# EAGLE design digimax-dual (EAGLE 4.13)
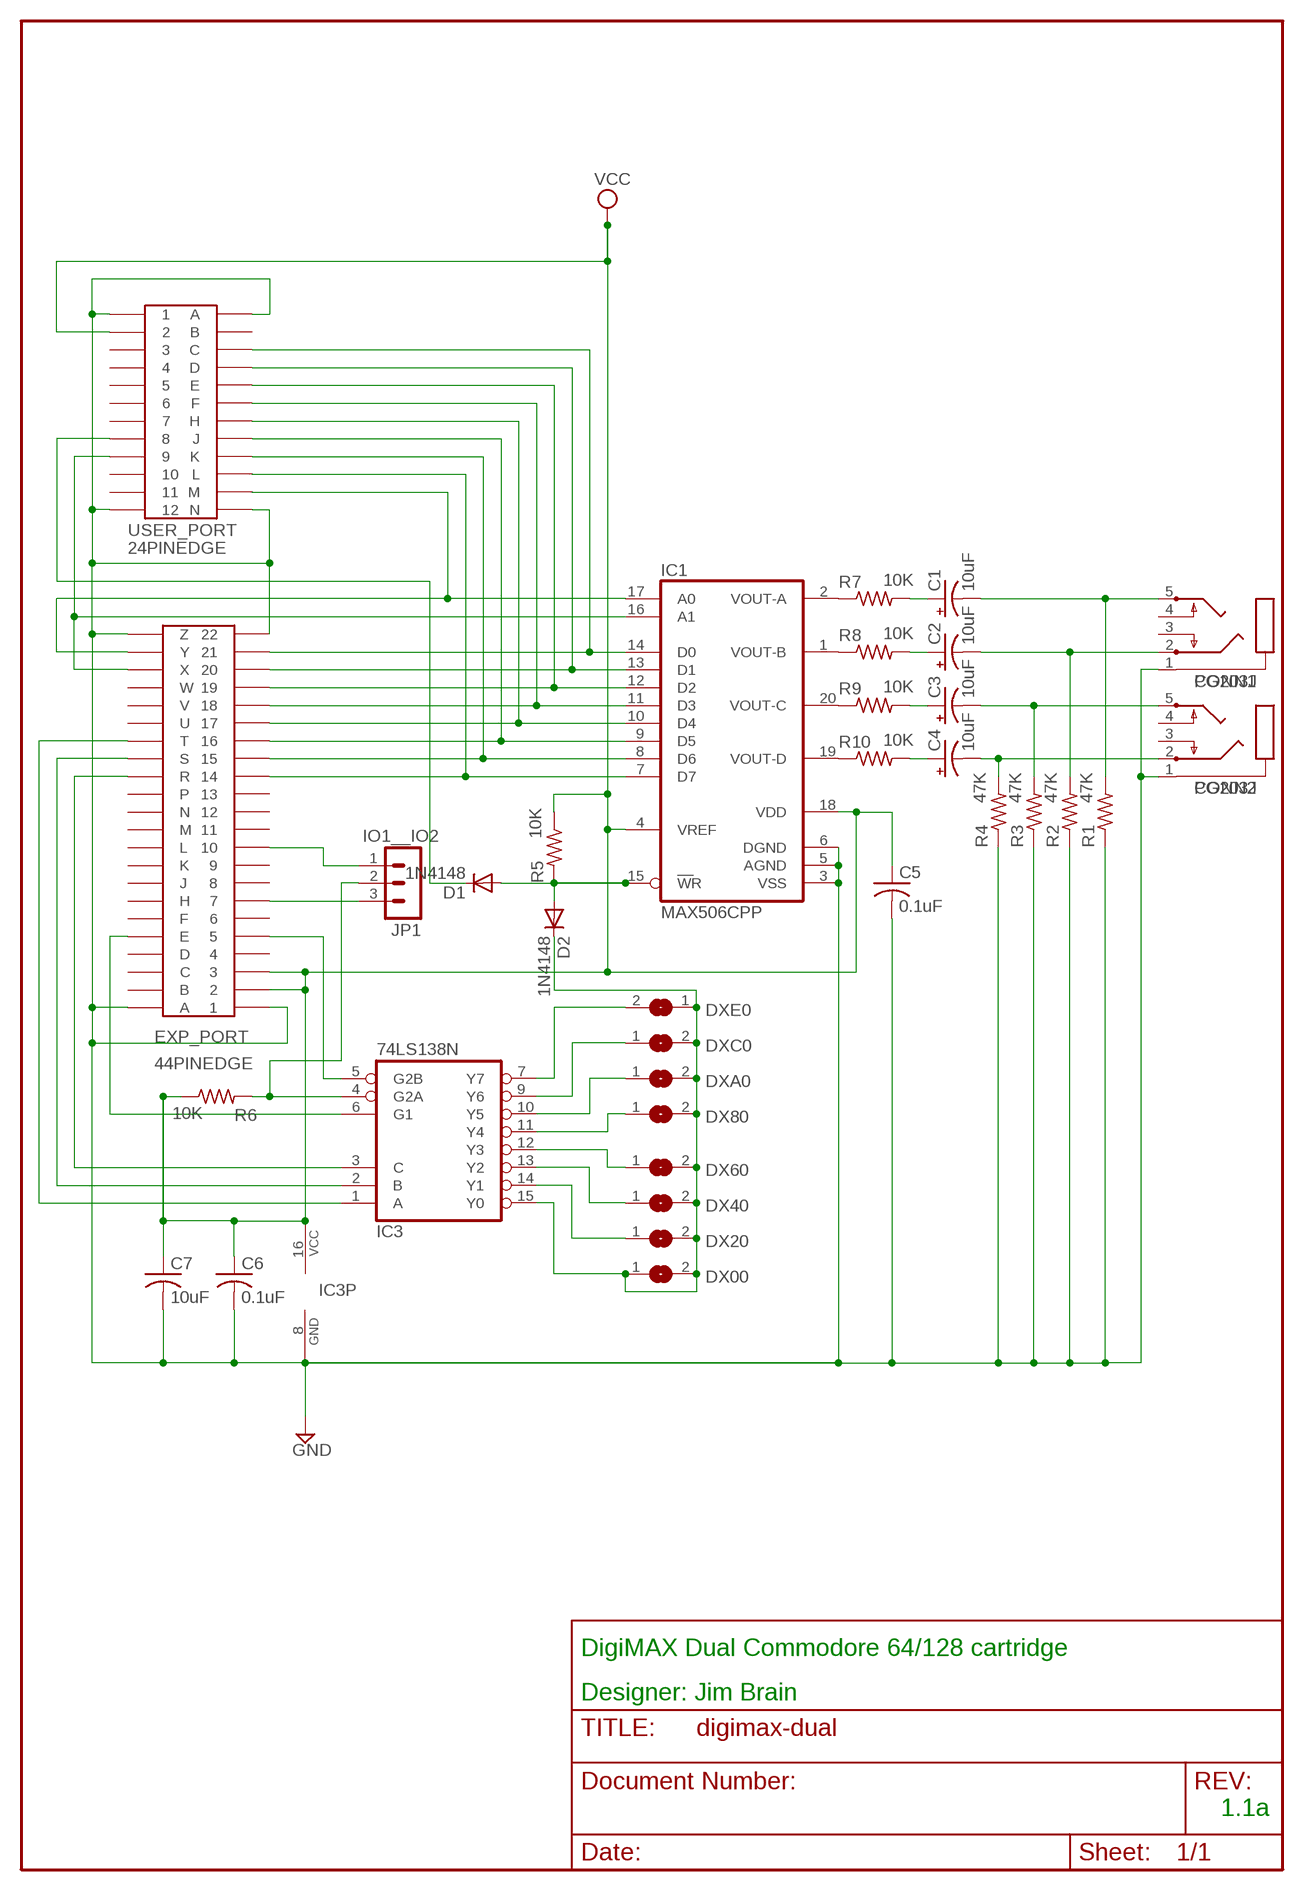
[diagram p0: schematic, sheet 1]

## Parts
C1  10uF  CPOL-USE2-4  [E2-4]
C2  10uF  CPOL-USE2-4  [E2-4]
C3  10uF  CPOL-USE2-4  [E2-4]
C4  10uF  CPOL-USE2-4  [E2-4]
C5  0.1uF  C-US025-024X044  [C025-024X044]
C6  0.1uF  C-US025-024X044  [C025-024X044]
C7  10uF  C-US025-025X050  [C025-025X050]
CONN1  PG203J  [PG203J]
CONN2  PG203J  [PG203J]
D1  1N4148  DIODE-D-2.5  [D-2.5]
D2  1N4148  DIODE-D-2.5  [D-2.5]
DX00  SJ  [SJ]
DX20  SJ  [SJ]
DX40  SJ  [SJ]
DX60  SJ  [SJ]
DX80  SJ  [SJ]
DXA0  SJ  [SJ]
DXC0  SJ  [SJ]
DXE0  SJ  [SJ]
EXP_PORT  44PINEDGE  [44PINEDGE]
IC1  MAX506CPP  [DIL20]
IC3  74LS138N  [DIL16]
JP1  IO1__IO2  MA03-1  [MA03-1]
R1  47K  R-US_0207/2V  [0207/2V]
R2  47K  R-US_0207/2V  [0207/2V]
R3  47K  R-US_0207/2V  [0207/2V]
R4  47K  R-US_0207/2V  [0207/2V]
R5  10K  R-US_0204/7  [0204/7]
R6  10K  R-US_0207/2V  [0207/2V]
R7  10K  R-US_0207/2V  [0207/2V]
R8  10K  R-US_0207/2V  [0207/2V]
R9  10K  R-US_0207/2V  [0207/2V]
R10  10K  R-US_0207/2V  [0207/2V]
USER_PORT  24PINEDGE  [24PINEDGE]

## Nets
GND: C5.2 C6.2 C7.2 CONN1.1 CONN2.1 EXP_PORT.1 EXP_PORT.22 EXP_PORT.A EXP_PORT.Z IC1.3(VSS) IC1.5(AGND) IC1.6(DGND) IC3.8(GND) R1.1 R2.1 R3.1 R4.1 USER_PORT.1 USER_PORT.12 USER_PORT.A USER_PORT.N
N$1: EXP_PORT.21 IC1.14(D0) USER_PORT.C
N$2: EXP_PORT.20 IC1.13(D1) USER_PORT.D
N$3: EXP_PORT.19 IC1.12(D2) USER_PORT.E
N$4: EXP_PORT.18 IC1.11(D3) USER_PORT.F
N$5: EXP_PORT.17 IC1.10(D4) USER_PORT.H
N$6: EXP_PORT.16 IC1.9(D5) USER_PORT.J
N$7: EXP_PORT.15 IC1.8(D6) USER_PORT.K
N$8: EXP_PORT.14 IC1.7(D7) USER_PORT.L
N$9: EXP_PORT.Y IC1.17(A0) USER_PORT.M
N$10: DXE0.2 IC3.7(Y7)
N$11: EXP_PORT.X IC1.16(A1) USER_PORT.9
N$12: EXP_PORT.10 JP1.1
N$13: D1.C USER_PORT.8
N$14: EXP_PORT.7 JP1.3
N$15: EXP_PORT.T IC3.1(A)
N$16: IC3.4(G2A) JP1.2 R6.2
N$17: C1.+ R7.2
N$18: C2.+ R8.2
N$19: C3.+ R9.2
N$20: C4.+ R10.2
N$21: C4.- CONN2.2 R4.2
N$22: C3.- CONN2.5 R3.2
N$23: C2.- CONN1.2 R2.2
N$24: C1.- CONN1.5 R1.2
N$25: EXP_PORT.S IC3.2(B)
N$26: EXP_PORT.R IC3.3(C)
N$27: DXC0.1 IC3.9(Y6)
N$28: EXP_PORT.5 IC3.5(G2B)
N$29: DXA0.1 IC3.10(Y5)
N$30: DX80.1 IC3.11(Y4)
N$31: DX60.1 IC3.12(Y3)
N$32: DX40.1 IC3.13(Y2)
N$33: DX20.1 IC3.14(Y1)
N$35: D2.C DX00.1 DX00.2 DX20.2 DX40.2 DX60.2 DX80.2 DXA0.2 DXC0.2 DXE0.1 IC3.15(Y0)
N$36: IC1.2(VOUT-A) R7.1
N$37: IC1.1(VOUT-B) R8.1
N$38: IC1.20(VOUT-C) R9.1
N$39: IC1.19(VOUT-D) R10.1
N$40: EXP_PORT.E IC3.6(G1)
N$41: D1.A D2.A IC1.15(WR) R5.2
VCC: C5.1 C6.1 C7.1 EXP_PORT.2 EXP_PORT.3 IC1.4(VREF) IC1.18(VDD) IC3.16(VCC) R5.1 R6.1 USER_PORT.2
Unconnected: CONN1.3 CONN1.4 CONN2.3 CONN2.4 EXP_PORT.4 EXP_PORT.6 EXP_PORT.8 EXP_PORT.9 EXP_PORT.11 EXP_PORT.12 EXP_PORT.13 EXP_PORT.B EXP_PORT.C EXP_PORT.D EXP_PORT.F EXP_PORT.H EXP_PORT.J EXP_PORT.K EXP_PORT.L EXP_PORT.M EXP_PORT.N EXP_PORT.P EXP_PORT.U EXP_PORT.V EXP_PORT.W USER_PORT.3 USER_PORT.4 USER_PORT.5 USER_PORT.6 USER_PORT.7 USER_PORT.10 USER_PORT.11 USER_PORT.B

## Notes on the sheet
- DigiMAX Dual Commodore 64/128 cartridge
- Designer: Jim Brain
- 1.1a

## Library data of the parts
C1-C4 = rcl:CPOL-US: POLARIZED CAPACITOR, American symbol
C5-C7 = rcl:C-US: CAPACITOR, American symbol
CONN1 CONN2 = con-hirschmann:PG203J: MIC/HEADPHONE JACK KS-S stereo microphone/headphone jack PG203JN (Schukat)
D1 D2 = diode:DIODE-: DIODE
DX00 DX20 DX40 DX60 DX80 DXA0 DXC0 DXE0 = jumper:SJ: SMD solder JUMPER
EXP_PORT = edge-100:44PINEDGE: 44 PIN EDGE CONNECTOR FOR PCB
IC1 = maxim:MAX506CPP: DIGITAL/ANALOG CONVERTER
IC3 = 74xx-us:74*138: 3-line to 8-line DECODER/DEMULTIPLEXER
JP1 = con-lstb:MA03-1: PIN HEADER
R1-R10 = rcl:R-US_: RESISTOR, American symbol
USER_PORT = edge-156:24PINEDGE

## Board
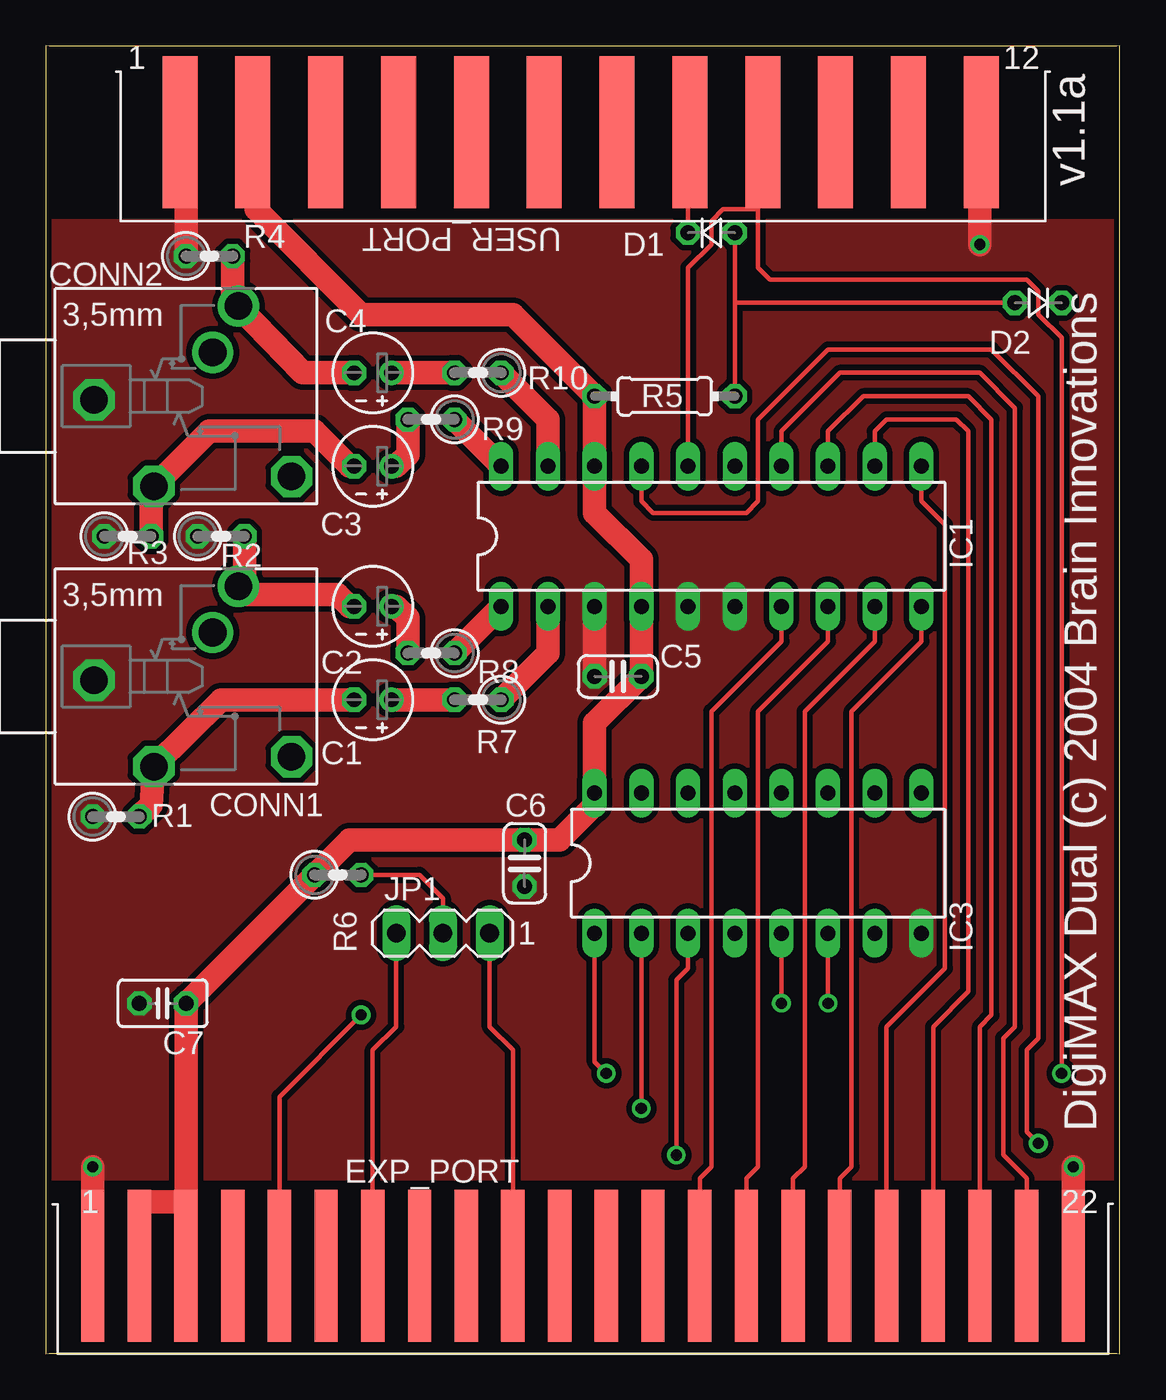
[diagram p1: board, top side]
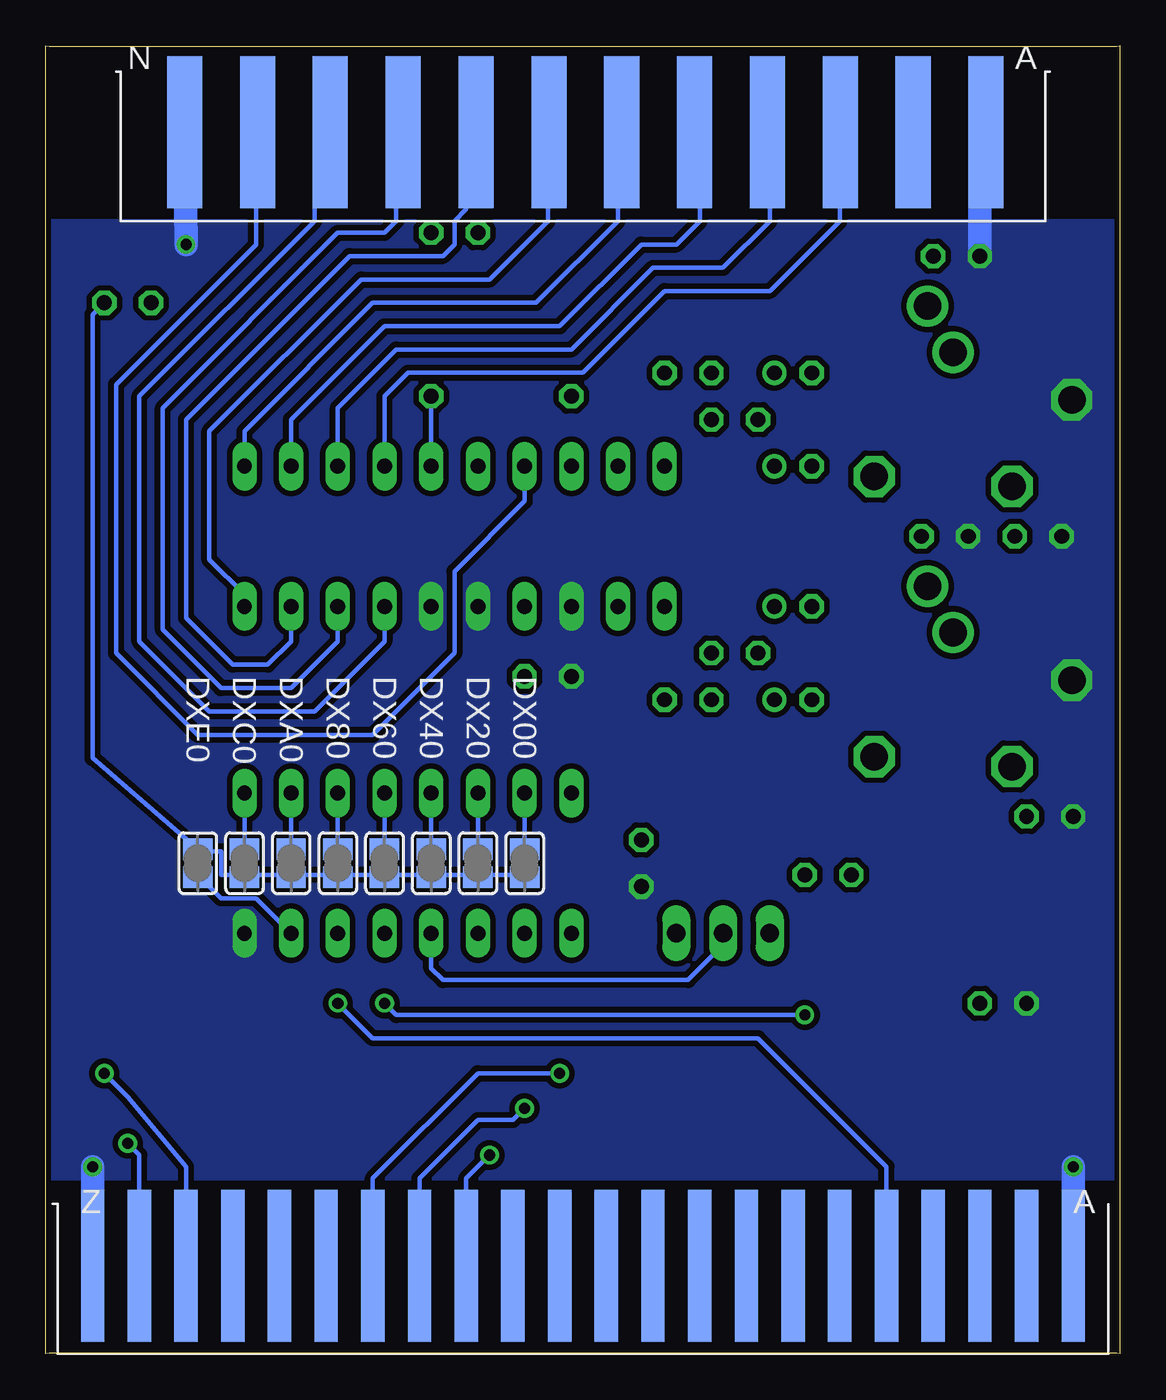
[diagram p2: board, bottom side, seen from below]

Size 58.42 x 71.12 mm. Coordinates in mm from the lower left corner, seen from the top.
Outline: 0.17,0.01 58.26,0.01 58.42,0 58.42,71.12 58.26,71.11 0.17,71.11 0,71.12 0,0 0.17,0.01
Copper layers (1*16): Top 0.035mm / dielectric 1.5mm / Bottom 0.035mm
Design rules "default": minimum track width 10mil, minimum drill 24mil, track to track 12mil, track to pad 12mil, pad to pad 12mil, via to via 12mil, smd to smd 12mil, copper to edge 12mil, drill to drill 8mil, minimum pad ring 10mil, minimum via ring 8mil, stop-mask expansion 4mil, vias tented up to drill 0mil, thermal gap 10mil

### Footprints (pad centres in the part's own frame; a part is rotated, then mirrored left to right if it is on the bottom)
E2-4 = drill 0.813 pad 1.27 round: + -1.016,0 | drill 0.813 pad 1.27 octagon: - 1.016,0
C025-024X044 = drill 0.813 octagon: 1 -1.27,0; 2 1.27,0
C025-025X050 = drill 0.813 octagon: 1 -1.27,0; 2 1.27,0
PG203J = drill 1.499 octagon: 1 -5.004,-0.203; 4 5.74,-4.369; 5 -1.753,-4.902 | drill 1.499 round: 2 2.845,4.902; 3 1.448,2.388
D-2.5 = drill 0.813 octagon: A 1.27,0; C -1.27,0
SJ = smd 1.168 x 1.6: 1 -0.762,0; 2 0.762,0
44PINEDGE = smd 1.27 x 8.255: 1 -24.765,-0.305; 2 -22.225,-0.305; 3 -19.685,-0.305; 4 -17.145,-0.305; 5 -14.605,-0.305; 6 -12.065,-0.305; 7 -9.525,-0.305; 8 -6.985,-0.305; 9 -4.445,-0.305; 10 -1.905,-0.305; 11 0.635,-0.305; 12 3.175,-0.305; 13 5.715,-0.305; 14 8.255,-0.305; 15 10.795,-0.305; 16 13.335,-0.305; 17 15.875,-0.305; 18 18.415,-0.305; 19 20.955,-0.305; 20 23.495,-0.305; 21 26.035,-0.305; 22 28.575,-0.305 | smd 1.27 x 8.255 bottom: A -24.765,-0.305; B -22.225,-0.305; C -19.685,-0.305; D -17.145,-0.305; E -14.605,-0.305; F -12.065,-0.305; H -9.525,-0.305; J -6.985,-0.305; K -4.445,-0.305; L -1.905,-0.305; M 0.635,-0.305; N 3.175,-0.305; P 5.715,-0.305; R 8.255,-0.305; S 10.795,-0.305; T 13.335,-0.305; U 15.875,-0.305; V 18.415,-0.305; W 20.955,-0.305; X 23.495,-0.305; Y 26.035,-0.305; Z 28.575,-0.305
DIL20 = drill 0.813 long: 1 -11.43,-3.81; 2 -8.89,-3.81; 3 -6.35,-3.81; 4 -3.81,-3.81; 5 -1.27,-3.81; 6 1.27,-3.81; 7 3.81,-3.81; 8 6.35,-3.81; 9 8.89,-3.81; 10 11.43,-3.81; 11 11.43,3.81; 12 8.89,3.81; 13 6.35,3.81; 14 3.81,3.81; 15 1.27,3.81; 16 -1.27,3.81; 17 -3.81,3.81; 18 -6.35,3.81; 19 -8.89,3.81; 20 -11.43,3.81
DIL16 = drill 0.813 long: 1 -8.89,-3.81; 2 -6.35,-3.81; 3 -3.81,-3.81; 4 -1.27,-3.81; 5 1.27,-3.81; 6 3.81,-3.81; 7 6.35,-3.81; 8 8.89,-3.81; 9 8.89,3.81; 10 6.35,3.81; 11 3.81,3.81; 12 1.27,3.81; 13 -1.27,3.81; 14 -3.81,3.81; 15 -6.35,3.81; 16 -8.89,3.81
MA03-1 = drill 1.016 long: 1 -2.54,0; 2 0,0; 3 2.54,0
0207/2V = drill 0.813 octagon: 1 -1.27,0; 2 1.27,0
0204/7 = drill 0.813 octagon: 1 -3.81,0; 2 3.81,0
24PINEDGE = smd 1.905 x 8.255: 1 -21.285,-0.254; 2 -17.323,-0.254; 3 -13.36,-0.254; 4 -9.398,-0.254; 5 -5.436,-0.254; 6 -1.473,-0.254; 7 2.489,-0.254; 8 6.452,-0.254; 9 10.414,-0.254; 10 14.376,-0.254; 11 18.339,-0.254; 12 22.301,-0.254 | smd 1.905 x 8.255 bottom: A -21.285,-0.254; B -17.323,-0.254; C -13.36,-0.254; D -9.398,-0.254; E -5.436,-0.254; F -1.473,-0.254; H 2.489,-0.254; J 6.452,-0.254; K 10.414,-0.254; L 14.376,-0.254; M 18.339,-0.254; N 22.301,-0.254

### Placement (x,y rotation side)
C1  17.78,35.56 180 top
C2  17.78,40.64 180 top
C3  17.78,48.26 180 top
C4  17.78,53.34 180 top
C5  31.11,36.83 180 top
C6  26.04,26.67 270 top
C7  6.35,19.05 180 top
CONN1  7.62,36.83 0 top
CONN2  7.62,52.07 0 top
D1  36.2,60.96 0 top
D2  53.98,57.15 180 top
DX00  32.38,26.67 270 bottom
DX20  34.92,26.67 270 bottom
DX40  37.47,26.67 270 bottom
DX60  40.01,26.67 270 bottom
DX80  42.55,26.67 270 bottom
DXA0  45.09,26.67 270 bottom
DXC0  47.62,26.67 270 bottom
DXE0  50.16,26.67 270 bottom
EXP_PORT  27.3,5.08 0 top
IC1  36.2,44.45 0 top
IC3  38.73,26.67 0 top
JP1  21.59,22.86 180 top
R1  3.81,29.21 0 top
R2  9.53,44.45 0 top
R3  4.45,44.45 0 top
R4  8.89,59.69 0 top
R5  33.66,52.07 0 top
R6  15.88,26.04 0 top
R7  23.5,35.56 180 top
R8  20.95,38.1 180 top
R9  20.95,50.8 180 top
R10  23.5,53.34 180 top
USER_PORT  28.57,66.67 0 top

### Tracks (layer width: path | path; a pad name or v marks a point on that pad's centre or on a via)
GND  (via drill 0.61)
  Top 1.27: C5.2 IC1.3 | EXP_PORT.22 v55.88,10.16 | USER_PORT.N 50.8,66.42 v50.8,60.33 | EXP_PORT.1 v2.54,10.16 | R4.1 7.62,62.87 USER_PORT.A
  Bottom 1.27: R4.1 7.62,62.87 USER_PORT.A | v55.88,10.16 EXP_PORT.22 | 2.54,5.08 EXP_PORT.1 v2.54,10.16 | v50.8,60.33 USER_PORT.N
  pour Bottom (no thermals): 0,61.59 58.42,61.59 58.42,9.53 0,9.53
  pour Top (no thermals): 0,61.59 58.42,61.59 58.42,9.53 0,9.53
N$1
  Top 0.254: EXP_PORT.21 53.34,9.53 52.07,10.79 52.07,17.14 52.7,17.78 52.7,51.44 50.8,53.34 43.18,53.34 40.01,50.16 IC1.14
  Bottom 0.254: USER_PORT.C 15.24,63.5 15.24,61.59 19.05,57.78 24.77,57.78 29.21,53.34 38.73,53.34 40.01,52.07 IC1.14
N$2
  Top 0.254: EXP_PORT.20 50.8,17.78 51.44,18.41 51.44,50.8 50.16,52.07 44.45,52.07 42.55,50.16 IC1.13
  Bottom 0.254: USER_PORT.D 19.05,63.5 19.05,61.59 21.59,59.05 25.4,59.05 29.84,54.61 39.37,54.61 42.55,51.44 IC1.13
N$3
  Top 0.254: EXP_PORT.19 48.26,17.78 50.16,19.68 50.16,50.16 49.53,50.8 45.72,50.8 45.09,50.16 IC1.12
  Bottom 0.254: USER_PORT.E 22.86,62.87 22.86,61.59 24.13,60.33 26.04,60.33 30.48,55.88 40.01,55.88 45.09,50.8 IC1.12
N$4
  Top 0.254: EXP_PORT.18 45.72,17.78 48.9,20.95 48.9,45.09 47.62,46.35 IC1.11
  Bottom 0.254: USER_PORT.F 27.3,63.5 27.3,61.59 31.75,57.15 40.64,57.15 47.62,50.16 IC1.11
N$5
  Top 0.254: EXP_PORT.17 43.18,9.53 43.81,10.16 43.81,34.92 47.62,38.73 IC1.10
  Bottom 0.254: USER_PORT.H 31.11,61.59 34.29,58.42 41.27,58.42 49.53,50.16 49.53,43.18 47.62,41.27 IC1.10
N$6
  Top 0.254: EXP_PORT.16 40.64,9.53 41.27,10.16 41.27,34.92 45.09,38.73 IC1.9
  Bottom 0.254: USER_PORT.J 35.56,62.23 36.2,61.59 36.2,60.33 36.83,59.69 41.91,59.69 50.8,50.8 50.8,40.01 48.26,37.47 46.35,37.47 45.09,38.73 IC1.9
N$7
  Top 0.254: EXP_PORT.15 38.1,9.53 38.73,10.16 38.73,34.92 42.55,38.73 IC1.8
  Bottom 0.254: USER_PORT.K 39.37,62.87 39.37,61.59 40.01,60.96 42.55,60.96 52.07,51.44 52.07,39.37 48.9,36.2 45.09,36.2 42.55,38.73 IC1.8
N$8
  Top 0.254: EXP_PORT.14 35.56,9.53 36.2,10.16 36.2,34.92 40.01,38.73 IC1.7
  Bottom 0.254: USER_PORT.L 43.81,64.14 43.81,61.59 53.34,52.07 53.34,38.73 49.53,34.92 43.81,34.92 40.01,38.73 IC1.7
N$9  (via drill 0.61)
  Top 0.254: v53.98,11.43 53.34,12.06 53.34,16.51 53.98,17.14 53.98,52.07 51.44,54.61 42.55,54.61 38.73,50.8 38.73,46.35 38.1,45.72 33.02,45.72 32.38,46.35 IC1.17
  Bottom 0.254: USER_PORT.M 46.99,62.23 46.99,60.33 54.61,52.7 54.61,38.1 50.16,33.66 40.64,33.66 36.2,38.1 36.2,42.55 32.38,46.35 IC1.17 | EXP_PORT.Y 53.34,10.79 v53.98,11.43
N$10
  Bottom 0.254: DXE0.2 49.53,25.4 48.9,24.77 46.99,24.77 IC3.7
N$11  (via drill 0.61)
  Top 0.254: 38.73,62.23 36.83,62.23 36.2,61.59 36.2,60.33 34.92,59.05 IC1.16 | v55.24,15.24 55.24,55.24 53.98,56.52 53.98,57.78 53.34,58.42 39.37,58.42 38.73,59.05 38.73,62.23 | 38.73,62.23 USER_PORT.9
  Bottom 0.254: EXP_PORT.X 50.8,10.16 53.98,13.97 v55.24,15.24
N$12
  Top 0.254: JP1.1 24.13,17.78 25.4,16.51 EXP_PORT.10
N$13
  Top 0.254: D1.C 34.92,62.87 34.29,62.87 USER_PORT.8
N$14
  Top 0.254: JP1.3 19.05,17.78 17.78,16.51 EXP_PORT.7
N$15  (via drill 0.61)
  Top 0.254: v30.48,15.24 29.84,15.88 IC3.1
  Bottom 0.254: v30.48,15.24 34.92,15.24 40.64,9.53 EXP_PORT.T
N$16
  Top 0.254: R6.2 20.32,26.04 21.59,24.77 JP1.2
  Bottom 0.254: IC3.4 37.47,20.95 36.83,20.32 23.5,20.32 21.59,22.23 JP1.2
N$17
  Top 1.27: C1.+ R7.2
N$18
  Top 1.27: C2.+ 19.05,40.64 19.68,40.01 R8.2
N$19
  Top 1.27: C3.+ 19.05,48.26 19.68,48.9 R9.2
N$20
  Top 1.27: C4.+ R10.2
N$21
  Top 1.27: R4.2 10.16,57.15 CONN2.2 13.97,53.34 C4.-
N$22
  Top 1.27: R3.2 5.71,46.99 CONN2.5 8.89,50.16 14.61,50.16 16.51,48.26 C3.-
N$23
  Top 1.27: C2.- 16.51,40.64 15.88,41.27 10.79,41.27 CONN1.2 10.79,41.91 R2.2
N$24
  Top 1.27: C1.- 9.53,35.56 CONN1.5 5.71,29.84 R1.2
N$25  (via drill 0.61)
  Top 0.254: v32.38,13.34 IC3.2
  Bottom 0.254: v32.38,13.34 33.02,12.7 34.92,12.7 38.1,9.53 EXP_PORT.S
N$26  (via drill 0.61)
  Top 0.254: v34.29,10.79 34.29,20.32 34.92,20.95 IC3.3
  Bottom 0.254: EXP_PORT.R 35.56,9.53 v34.29,10.79
N$27
  Bottom 0.254: DXC0.1 IC3.9
N$28  (via drill 0.61)
  Top 0.254: v17.14,18.41 12.7,13.97 EXP_PORT.5 | v40.01,19.05 IC3.5
  Bottom 0.254: v17.14,18.41 39.37,18.41 v40.01,19.05
N$29
  Bottom 0.254: DXA0.1 IC3.10
N$30
  Bottom 0.254: DX80.1 IC3.11
N$31
  Bottom 0.254: DX60.1 IC3.12
N$32
  Bottom 0.254: DX40.1 IC3.13
N$33
  Bottom 0.254: DX20.1 IC3.14
N$35
  Bottom 0.254: DXE0.1 49.53,27.3 48.9,27.3 48.9,26.04 48.26,26.04 DXC0.2 46.99,26.04 45.72,26.04 DXA0.2 44.45,26.04 43.18,26.04 DX80.2 41.91,26.04 40.64,26.04 DX60.2 39.37,26.04 38.1,26.04 DX40.2 36.83,26.04 35.56,26.04 DX20.2 34.29,26.04 33.02,26.04 DX00.2 DX00.1 IC3.15 | D2.C 55.88,56.52 55.88,32.38 DXE0.1 | DXE0.1 50.16,27.3
N$36
  Top 1.27: IC1.2 27.3,38.1 R7.1
N$37
  Top 1.27: R8.1 IC1.1
N$38
  Top 1.27: R9.1 IC1.20
N$39
  Top 1.27: IC1.19 27.3,50.8 R10.1
N$40  (via drill 0.61)
  Top 0.254: v42.55,19.05 IC3.6
  Bottom 0.254: v42.55,19.05 40.64,17.14 19.68,17.14 12.7,10.16 EXP_PORT.E
N$41
  Top 0.254: 37.47,57.15 D2.A | R5.2 37.47,57.15 | 37.47,57.15 D1.A
  Bottom 0.254: IC1.15 R5.2
VCC
  Top 0.254: 7.62,8.26 7.62,8.89
  Top 1.27: EXP_PORT.2 5.08,8.26 7.62,8.26 EXP_PORT.3 | USER_PORT.2 11.43,62.23 17.14,56.52 25.4,56.52 R5.1 | R5.1 IC1.18 29.84,45.72 32.38,43.18 IC1.4 C5.1 29.84,34.29 IC3.16 29.84,29.84 27.94,27.94 C6.1 16.51,27.94 R6.1 C7.1 7.62,8.89 | R5.1 29.84,51.44

### Text on the board
tPlace: v1.1a | DigiMAX Dual (c) 2004 Brain Innovations